# EAGLE schematic bluetooth (EAGLE 6.0)
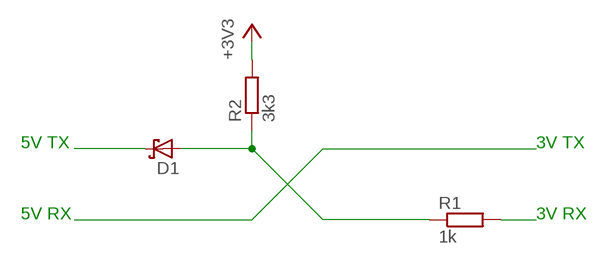
[diagram p0: schematic, sheet 1]

## Parts
D1  SCHOTTKY-DIODEF126Z12  [F126Z12]
R1  1k  R-EU_0207/5V  [0207/5V]
R2  3k3  R-EU_0207/5V  [0207/5V]

## Nets
+3V3: R2.2
N$1: D1.A R1.1 R2.1
N$2: R1.2
N$4: D1.C

## Notes on the sheet
- 5V TX | 3V TX
- 5V RX | 3V RX

## Library data of the parts
D1 = diode:SCHOTTKY-DIODE: Schottky Diode
R1 R2 = rcl:R-EU_: RESISTOR, European symbol